# EAGLE design labortagebadge_2011 (EAGLE 6.0)
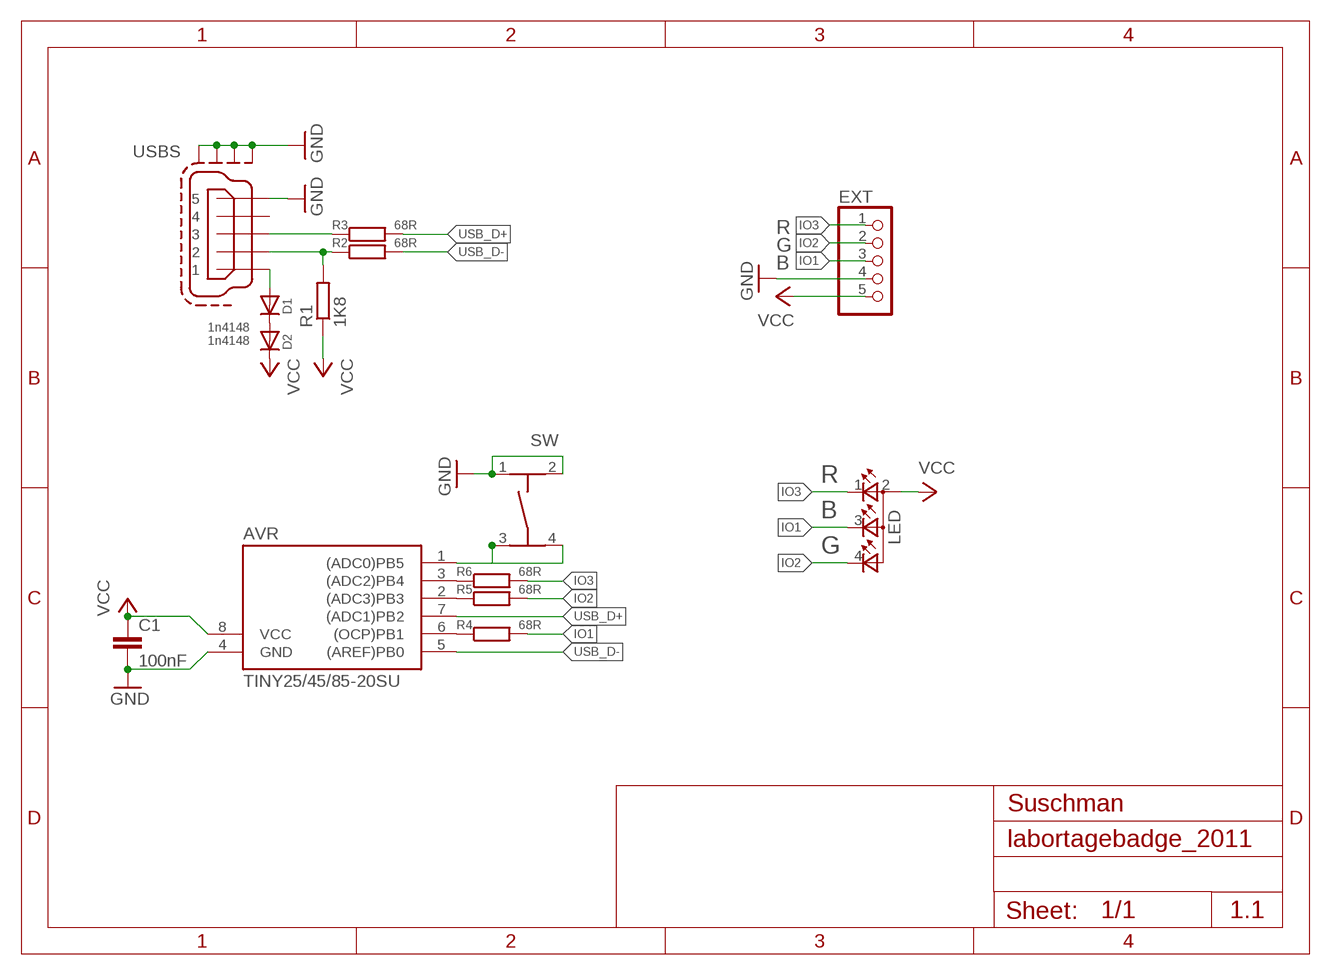
[diagram p0: schematic, sheet 1]

## Parts
AVR  TINY25/45/85-20SU  [SOIC8]
C1  100nF  C-EUC0805K  [C0805K]
D1  1n4148  DIODE-MINIMELF  [MINIMELF]
D2  1n4148  DIODE-MINIMELF  [MINIMELF]
EXT  PINHD-1X5  [1X05]
LED  TOPLED-3  [P-LCC-4-3]
R1  1K8  R-EU_R0805  [R0805]
R2  68R  R-EU_R0805  [R0805]
R3  68R  R-EU_R0805  [R0805]
R4  68R  R-EU_R0805  [R0805]
R5  68R  R-EU_R0805  [R0805]
R6  68R  R-EU_R0805  [R0805]
SW  TASTER-9314_SMD  [TASTER-9314_SMD]
USB  MINI-USB-SCHIELD-32005-201  [32005-201]

## Nets
GND: AVR.4(GND) C1.2 EXT.4 SW.1 SW.2 USB.5 USB.M1(S:S1) USB.M2(S:S2) USB.M3(S:S3) USB.M4(S:S4)
IO1: EXT.3 LED.3(CBLUE) R4.2
IO2: EXT.2 LED.4(CGREEN) R5.2
IO3: EXT.1 LED.1(CRED) R6.2
N$1: AVR.1((ADC0)PB5) SW.3 SW.4
N$2: D1.C D2.A
N$4: R1.2 R2.1 USB.2
N$5: R3.1 USB.3
N$6: D1.A USB.1
N$8: AVR.6((OCP)PB1) R4.1
N$9: AVR.2((ADC3)PB3) R5.1
N$10: AVR.3((ADC2)PB4) R6.1
USB_D+: AVR.7((ADC1)PB2) R3.2
USB_D-: AVR.5((AREF)PB0) R2.2
VCC: AVR.8(VCC) C1.1 D2.C EXT.5 LED.2(A2) R1.1
Unconnected: USB.4

## Notes on the sheet
- R
- G
- B
- R
- B
- G
- Suschman
- 1.1

## Library data of the parts
AVR = avr-7:TINY25/45/85
C1 = rcl:C-EU: CAPACITOR, European symbol
D1 D2 = diode:DIODE-: DIODE
EXT = labtagebadge:PINHD-1X5: PIN HEADER
LED = labtagebadge:TOPLED-3: OSRAM - Hyper Multi TOPLED® (RGB) LB E673, LV E673, LT E673 - Power TOPLED® Enhanced optical Power LED (HOP2000) LS E67B, LA E67B, LO E67B, LY E67B - Hyper Multi TOPLED® Enhanced optical Power LED (HOP2000 / ATON®) LATB T66B - Hyper Multi TOPLED® Hyper-Bright LED LATB T686 Source: http://www.osram.convergy.de/
R1-R6 = rcl:R-EU_: RESISTOR, European symbol
SW = labtagebadge:TASTER-9314_SMD
USB = con-cypressindustries:MINI-USB-SCHIELD-: MINI USB-B Conector Source: www.cypressindustries.com; OC_FARNELL: unknown; OC_NEWARK: unknown

## Board
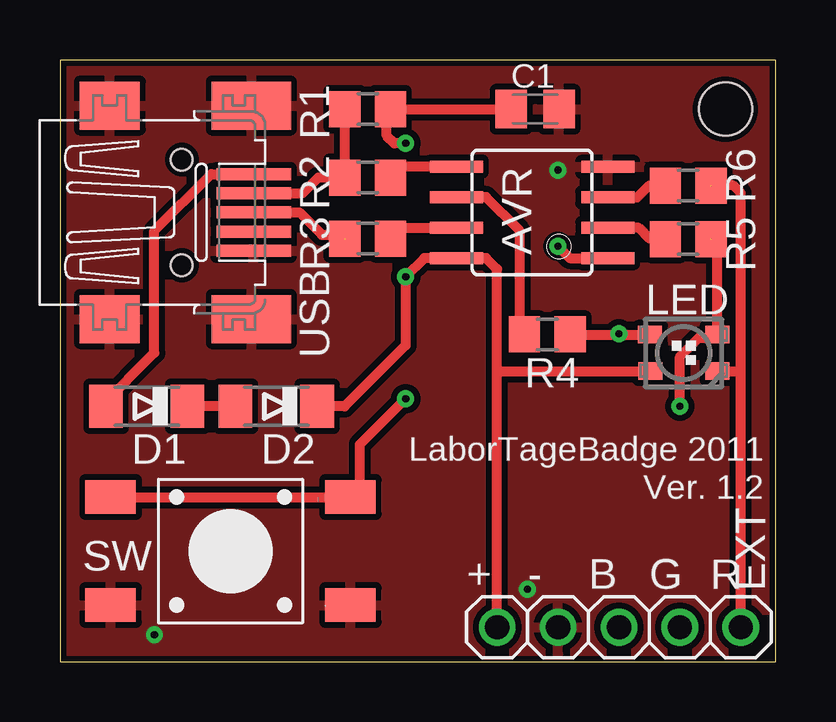
[diagram p1: board, top side]
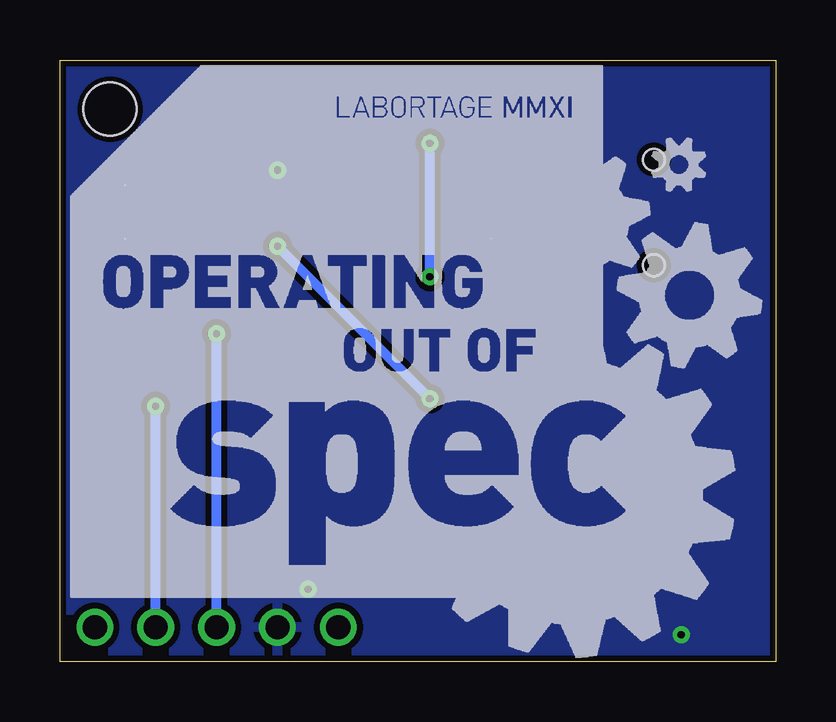
[diagram p2: board, bottom side, seen from below]

Size 29.84 x 25.07 mm. Coordinates in mm from the lower left corner, seen from the top.
Outline: 0,25.07 0,0 29.84,0 29.84,25.07 0,25.07
Copper layers (1*16): Top 0.035mm / dielectric 1.5mm / Bottom 0.035mm
Design rules: minimum track width 10mil, minimum drill 0.3mm, track to track 8mil, track to pad 8mil, pad to pad 8mil, via to via 8mil, smd to smd 8mil, copper to edge 10mil, drill to drill 8mil, minimum pad ring 10mil, minimum via ring 8mil, stop-mask expansion 4mil, vias tented up to drill 0.3mm, thermal gap 10mil
Holes 2.2 mm at 27.75,23.03

### Footprints (pad centres in the part's own frame; a part is rotated, then mirrored left to right if it is on the bottom)
SOIC8 = smd 0.5 x 2.2: 1 -1.905,-3.154; 2 -0.645,-3.154; 3 0.625,-3.154; 4 1.895,-3.154; 5 1.905,3.154; 6 0.635,3.154; 7 -0.635,3.154; 8 -1.905,3.154
C0805K = smd 1.3 x 1.6: 1 -1,0; 2 1,0
MINIMELF = smd 1.4 x 1.8: A 1.7,0; C -1.7,0
1X05 = drill 1.016: 1 -5.08,0; 2 -2.54,0; 3 0,0; 4 2.54,0; 5 5.08,0
P-LCC-4-3 = smd 0.725 x 1: 1 -0.762,-1.404; 2 -0.762,1.397; 3 0.762,1.404; 4 0.762,-1.404
R0805 = smd 1.3 x 1.5: 1 -0.95,0; 2 0.95,0
TASTER-9314_SMD = smd 2.1 x 1.4: 1 -5,2.25; 2 5,2.25; 3 -5,-2.25; 4 5,-2.25
32005-201 = smd 3.1 x 0.5: 1 3,1.6; 2 3,0.8; 3 3,0; 4 3,-0.8; 5 3,-1.6 | smd 2.5 x 2: M1 -3,-4.45; M2 -3,4.45 | smd 3.3 x 2: M3 2.9,4.45; M4 2.9,-4.45 | hole 0.9: 0,2.2; 0,-2.2

### Placement (x,y rotation side)
AVR  19.68,18.72 90 top
C1  19.81,23.03 0 top
D1  3.62,10.64 180 top
D2  9.02,10.64 180 top
EXT  23.3,1.44 180 top
LED  26,12.87 90 top
R1  12.83,23.03 180 top
R2  12.83,20.17 0 top
R3  12.83,17.63 0 top
R4  20.32,13.64 0 top
R5  26.19,17.61 0 top
R6  26.19,19.83 0 top
SW  7.11,4.61 180 top
USB  5.08,18.72 0 top

### Tracks (layer width: path | path; a pad name or v marks a point on that pad's centre or on a via)
GND  (via drill 0.3)
  other vias: 3.94,1.12 19.49,3.02 20.76,20.49
  pour Top (isolate 0.254): 29.97,25.25 29.97,-0.15 -0.19,-0.15 -0.19,25.25
  pour Bottom (isolate 0.254): 29.97,25.25 29.97,-0.15 -0.19,-0.15 -0.19,25.25
IO1  (via drill 0.3)
  Top 0.406: 23.3,13.63 21.18,13.63 R4.2 | 23.3,13.63 LED.3 | v23.3,13.66 23.3,13.63
  Bottom 0.406: EXT.3 v23.3,13.66
IO2  (via drill 0.3)  (1 unrouted)
  Top 0.406: v25.84,10.64 25.84,12.71 26.64,13.5 27.12,13.5 LED.4 27.41,17.34 27.11,17.63
  Bottom 0.406: EXT.2 v25.84,10.64
IO3  (1 unrouted)
  Top 0.406: LED.1 27.43,12.06 | 27.27,12.08 LED.1 | 27.28,12.07 LED.1 | EXT.1 28.38,12.07 | 28.38,12.07 28.38,19.53 28.07,19.85 27.11,19.85 27.27,19.69 | LED.1 28.35,12.1 28.38,12.07
N$1  (via drill 0.3)
  Top 0.406: SW.4 SW.3 12.51,6.94 12.51,9.05 v14.41,10.96 | AVR.1 21.26,16.81 v20.76,17.31
  Bottom 0.406: v14.41,10.96 v20.76,17.31
N$2
  Top 0.406: D2.A D1.C
N$4
  Top 0.406: USB.2 10.12,19.52 10.76,20.17 R2.1 R1.2
N$5  (1 unrouted)
  Top 0.406: USB.3 9.99,18.72 10.92,17.79 11.72,17.79 R3.1
N$6
  Top 0.406: USB.1 6.31,20.32 3.94,17.95 3.94,12.87 1.71,10.64 D1.A
N$8
  Top 0.406: AVR.6 17.77,19.35 19.18,17.95 19.18,13.93 R4.1
N$9
  Top 0.406: AVR.2 24.13,18.07 24.57,17.63 25.32,17.63 R5.1
N$10
  Top 0.406: AVR.3 24.07,19.34 24.57,19.85 25.36,19.85 R6.1
USB_D+
  Top 0.406: AVR.7 13.82,18.08 R3.2
USB_D-
  Top 0.406: AVR.5 14.24,20.62 R2.2
VCC  (via drill 0.3)
  Top 0.406: D2.C 11.87,10.64 14.41,13.18 v14.41,16.04 15.19,16.81 AVR.8 17.77,16.81 18.22,16.36 18.22,12.23 | EXT.5 18.22,12.23 | LED.2 18.35,12.1 18.22,12.23 | R1.1 13.62,23.02 13.46,22.87 | R1.1 C1.1 | v14.41,21.6 13.94,21.6 13.62,21.91 13.62,22.87 R1.1
  Bottom 0.406: v14.41,16.04 v14.41,21.6

### Text on the board
tNames: LaborTageBadge 2011 | Ver. 1.2 | + | - | B | G | R